# Altium schematic sheet 3_3V3LDO.SchDoc
size A4; PageSetup: Record=PageOptions|CenterHorizontal=True|CenterVertical=True|PrintScale=1.00|XCorrection=1.00|YCorrection=1.00|PrintKind=1|BorderSize=5000000|LeftOffset=0|BottomOffset=0|Orientation=2|PaperLength=1000|PaperWidth=1000|Scale=100|PaperSource=7|PrintQuality=-3|MediaType=1|DitherType=10|PrintScaleMode=1|PaperKind=Executive|PaperIndex=7
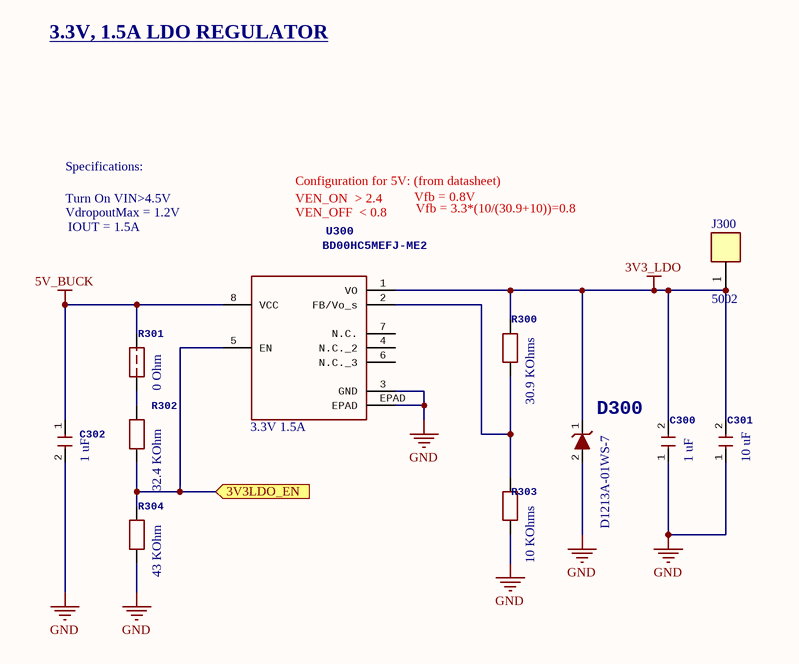
[diagram p0: 3_3V3LDO.SchDoc]

## Parts
C300  value 1 uF  [CAP_0603]  (hidden comment: GCM188R71C105KA64)
C301  value 10 uF  [CAP_0603]  (hidden comment: GRM188R61E106KA73D)
C302  value 1 uF  [CAP_0603]  (hidden comment: GRT188R61H105KE13D)
D300  D1213A-01WS-7  [DIODE_DO-214AC]
J300  5002  [KEYSTONE_5002]
R300  value 30.9 KOhms  [RES_0603]  (hidden comment: ERJ6ENF3092V)
R301  value 0 Ohm  [RES_0603]  (hidden comment: ERJ3GEY0R00V)
R302  value 32.4 KOhm  [RES_0603]  (hidden comment: RC0603FR-0732K4L)
R303  value 10 KOhms  [RES_0603]  (hidden comment: ERJ3GEYJ103V)
R304  value 43 KOhm  [RES_0603]  (hidden comment: ERJ3GEYJ433V)
U300  BD00HC5MEFJ-ME2  value 3.3V 1.5A  [REG_SOP8_SOIC8_EPAD]

## Ports
3V3LDO_EN (in)

## Nets
3V3_LDO: C300.2 C301.2 D300.1 J300.1 R300.2 U300.1(VO)
5V_BUCK: C302.1 R301.2 U300.8(VCC)
GND: C300.1 C301.1 C302.2 D300.2 R303.1 R304.1 U300.3(GND) U300.EPAD
3V3LDO_EN: R302.2 R304.2 U300.5(EN) ; port 3V3LDO_EN
NetR300_1: R300.1 R303.2 U300.2(FB/Vo_s)
NetR301_1: R301.1 R302.1

Not connected (* = marked no-connect by the designer): U300 4(N.C._2) 6(N.C._3) 7(N.C.)

## Notes on the sheet
- 3.3V, 1.5A LDO REGULATOR
- Turn On VIN>4.5V
- Specifications:
- VEN_ON  > 2.4
- Configuration for 5V: (from datasheet)
- Vfb = 0.8V
- VdropoutMax = 1.2V
- IOUT = 1.5A
- VEN_OFF  < 0.8
- Vfb = 3.3*(10/(30.9+10))=0.8

## Library data of the parts
C300 = GCM188R71C105KA64D: Cap Ceramic 1uF 16V 0603; Manufacturer_Name: Murata Electronics; GateName_1: G$1; SymbolName_1: GCM188R71C105KA64D; LibraryName: GCM188R71C105KA64D; DeviceSetName: GCM188R71C105KA64D; Manufacturer_Part_Number: GCM188R71C105KA64D; Mouser_Part_Number: 81-GCM188R71C105K64D; Mouser_Price-Stock: https://www.mouser.co.uk/ProductDetail/Murata-Electronics/GCM188R71C105KA64D?qs=bQrJpfqjX%252BKtVgLYIBGvIg%3D%3D; Arrow_Part_Number: GCM188R71C105KA64D; Arrow_Price-Stock: https://www.arrow.com/en/products/gcm188r71c105ka64d/murata-manufacturing?region=nac; Height: 0.9mm; Link: https://www.digikey.ca/en/products/detail/murata-electronics/GCM188R71C105KA64D/1979250; Package: 0603; PartNumber: GCM188R71C105KA64; SupplierPartNumber: 490-5241-2-ND; SuppliersPartNumber: C161212
C301 = GRM188R61E106KA73D: Cap Ceramic 10uF 35V 0603; Manufacturer_Name: Murata Electronics; Link: https://www.digikey.ca/en/products/detail/murata-electronics/GRM188R61E106KA73D/9867922?s=N4IgTCBcDaIOICUCyBGAHGhA2FBRFADFgNICCA7AMwAiIAugL5A; Package: 0603; PartNumber: GRM188R61E106KA73D; SupplierPartNumber: 490-18214-2-ND; SuppliersPartNumber: C344022
C302 = GRT188R61H105KE13D: Cap Ceramic 1uF 50V 0603; Manufacturer: Murata Electronics; PartNumber: GCM188R71C105KA64; Link: https://www.digikey.ca/en/products/detail/murata-electronics/GRT188R61H105KE13D/5416752?s=N4IgTCBcDaIOICUAqBGAHGhA2FAJFADAKwDSAoigMwAiIAugL5A; Package: 0603; SupplierPartNumber: 490-12330-2-ND; SuppliersPartNumber: C126631
D300 = D1213A-01WS-7: Diode TVS 3V3; Manufacturer: Diodes Inc; Value: TVS 3V3; Link: https://www.digikey.ca/en/products/detail/diodes-incorporated/D1213A-01WS-7/3340446?s=N4IgTCBcDaICIEYwIMwEEC0AGBB1AyhgOwgC6AvkA; Package: SOD-323; PartNumber: D1213A-01WS-7; SupplierPartNumber: D1213A-01WS-7DITR-ND; SuppliersPartNumber: C170167
J300 = 5002: Test Point Ring Keystone; Manufacturer: Keystone Electronics; Value: Test Point Keystone Electronics; Package: *; PartNumber: 5002; SupplierNumber: 36-5002-ND; SuppliersPartNumber: C238123; Link: https://www.digikey.ca/en/products/detail/keystone-electronics/5002/255328
R300 = ERJ6ENF3092V: Res 30.9KOhms 1/8W 0603; Link: https://www.digikey.ca/en/products/detail/panasonic-electronic-components/ERJ-6ENF3092V/111570?s=N4IgTCBcDaIKICUBSA2OA5AYgZgAwE4wA1EAXQF8g; Package: 0603; PartNumber: ERJ6ENF3092V; SupplierPartNumber: P30.9KCTR-ND; SuppliersPartNumber: C416839
R301 = ERJ3GEY0R00V: Res 0Ohm 1/10W 0603; Link: https://www.digikey.ca/en/products/detail/panasonic-electronic-components/ERJ-3GEY0R00V/135656?s=N4IgTCBcDaIKICUBSBmA4nAmgBgd7AaiALoC%2BQA; Package: 0603; SupplierPartNumber: P0.0GTR-ND; SuppliersPartNumber: C122704; PartNumber: ERJ3GEY0R00V
R302 = RC0603FR-0732K4L: Res 32.4KOhm 1/10W 0603; Link: https://www.digikey.ca/en/products/detail/RC0603FR-0732K4L/311-32.4KHRCT-ND/730102?curr=cad&utm_campaign=buynow&utm_medium=aggregator&utm_source=octopart; Package: 0603; PartNumber: RC0603FR-0732K4L; SupplierPartNumber: 311-32.4KHRCT-ND; SuppliersPartNumber: C309561
R303 = ERJ3GEYJ103V: Res 10KOhms 1/10W 0603; Link: https://www.mouser.ca/ProductDetail/Panasonic/ERJ-3GEYJ103V?qs=66DK8nO8gJBWgc%252B0VNNxzg%3D%3D; Package: 0603; PartNumber: ERJ3GEYJ103V; SupplierPartNumber: 667-ERJ-3GEYJ103V; SuppliersPartNumber: C169849
R304 = ERJ3GEYJ433V: Res 43KOhm 1/10W 0603; Manufacturer_Name: Panasonic; Height: 0.55mm; Link: https://www.digikey.ca/en/products/detail/panasonic-electronic-components/ERJ-3GEYJ433V/104624; Package: 0603; PartNumber: ERJ3GEYJ433V; SupplierPartNumber: P43KGTR-ND; SuppliersPartNumber: C403499
U300 = BD00HC5MEFJ-ME2: LDO 5Vin 3V3Out 1.5A; Manufacturer: ROHM Semiconductor; PartNumber: BD00HC5MEFJ-ME2; SupplierNumber: BD00HC5MEFJ-ME2TR-ND; Link: https://www.digikey.ca/en/products/detail/rohm-semiconductor/BD00HC5MEFJ-ME2/4625492?s=N4IgTCBcDaIEYBMAMSAWBjArAWwKYDMArAWjwgF0BfIA; Package: 8-SOIC; SuppliersPartNumber: *